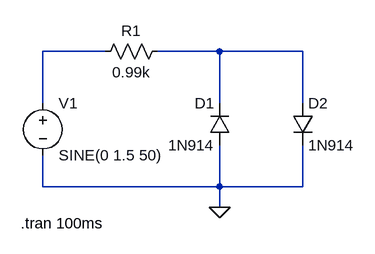
[diagram p0: schematic sim4shema.asc]
sim4shema.asc, the LTspice schematic file:
Version 4
SHEET 1 880 680
WIRE 160 80 64 80
WIRE 336 80 240 80
WIRE 464 80 336 80
WIRE 64 160 64 80
WIRE 336 160 336 80
WIRE 464 160 464 80
WIRE 64 288 64 240
WIRE 336 288 336 224
WIRE 336 288 64 288
WIRE 464 288 464 224
WIRE 464 288 336 288
WIRE 336 320 336 288
FLAG 336 320 0
SYMBOL voltage 64 144 R0
WINDOW 123 0 0 Left 2
WINDOW 39 0 0 Left 2
SYMATTR InstName V1
SYMATTR Value SINE(0 1.5 50)
SYMBOL res 256 64 R90
WINDOW 0 0 56 VBottom 2
WINDOW 3 32 56 VTop 2
SYMATTR InstName R1
SYMATTR Value 0.99k
SYMBOL diode 352 224 R180
WINDOW 0 24 64 Left 2
WINDOW 3 24 0 Left 2
SYMATTR InstName D1
SYMATTR Value 1N914
SYMBOL diode 448 160 R0
SYMATTR InstName D2
SYMATTR Value 1N914
TEXT 30 344 Left 2 !.tran 100ms

The netlist it stands for:
* sim4shema.asc
V1 N001 0 SINE(0 1.5 50)
R1 N002 N001 0.99k
D1 0 N002 1N914
D2 N002 0 1N914
.model D D
.lib standard.dio
.tran 100ms
.backanno
.end